# Altium schematic sheet CPCIS_Connectors_P1_P6.SchDoc: =DocumentName
size A3; SPICEModelCacheRMUUFYQV: <root> / <DocumentId>RMUUFYQV</DocumentId> / </root>; DocumentNumber: 1; Revision: 0; SheetNumber: 6; SheetTotal: 17; Last modified by: Krzysztof Belewicz
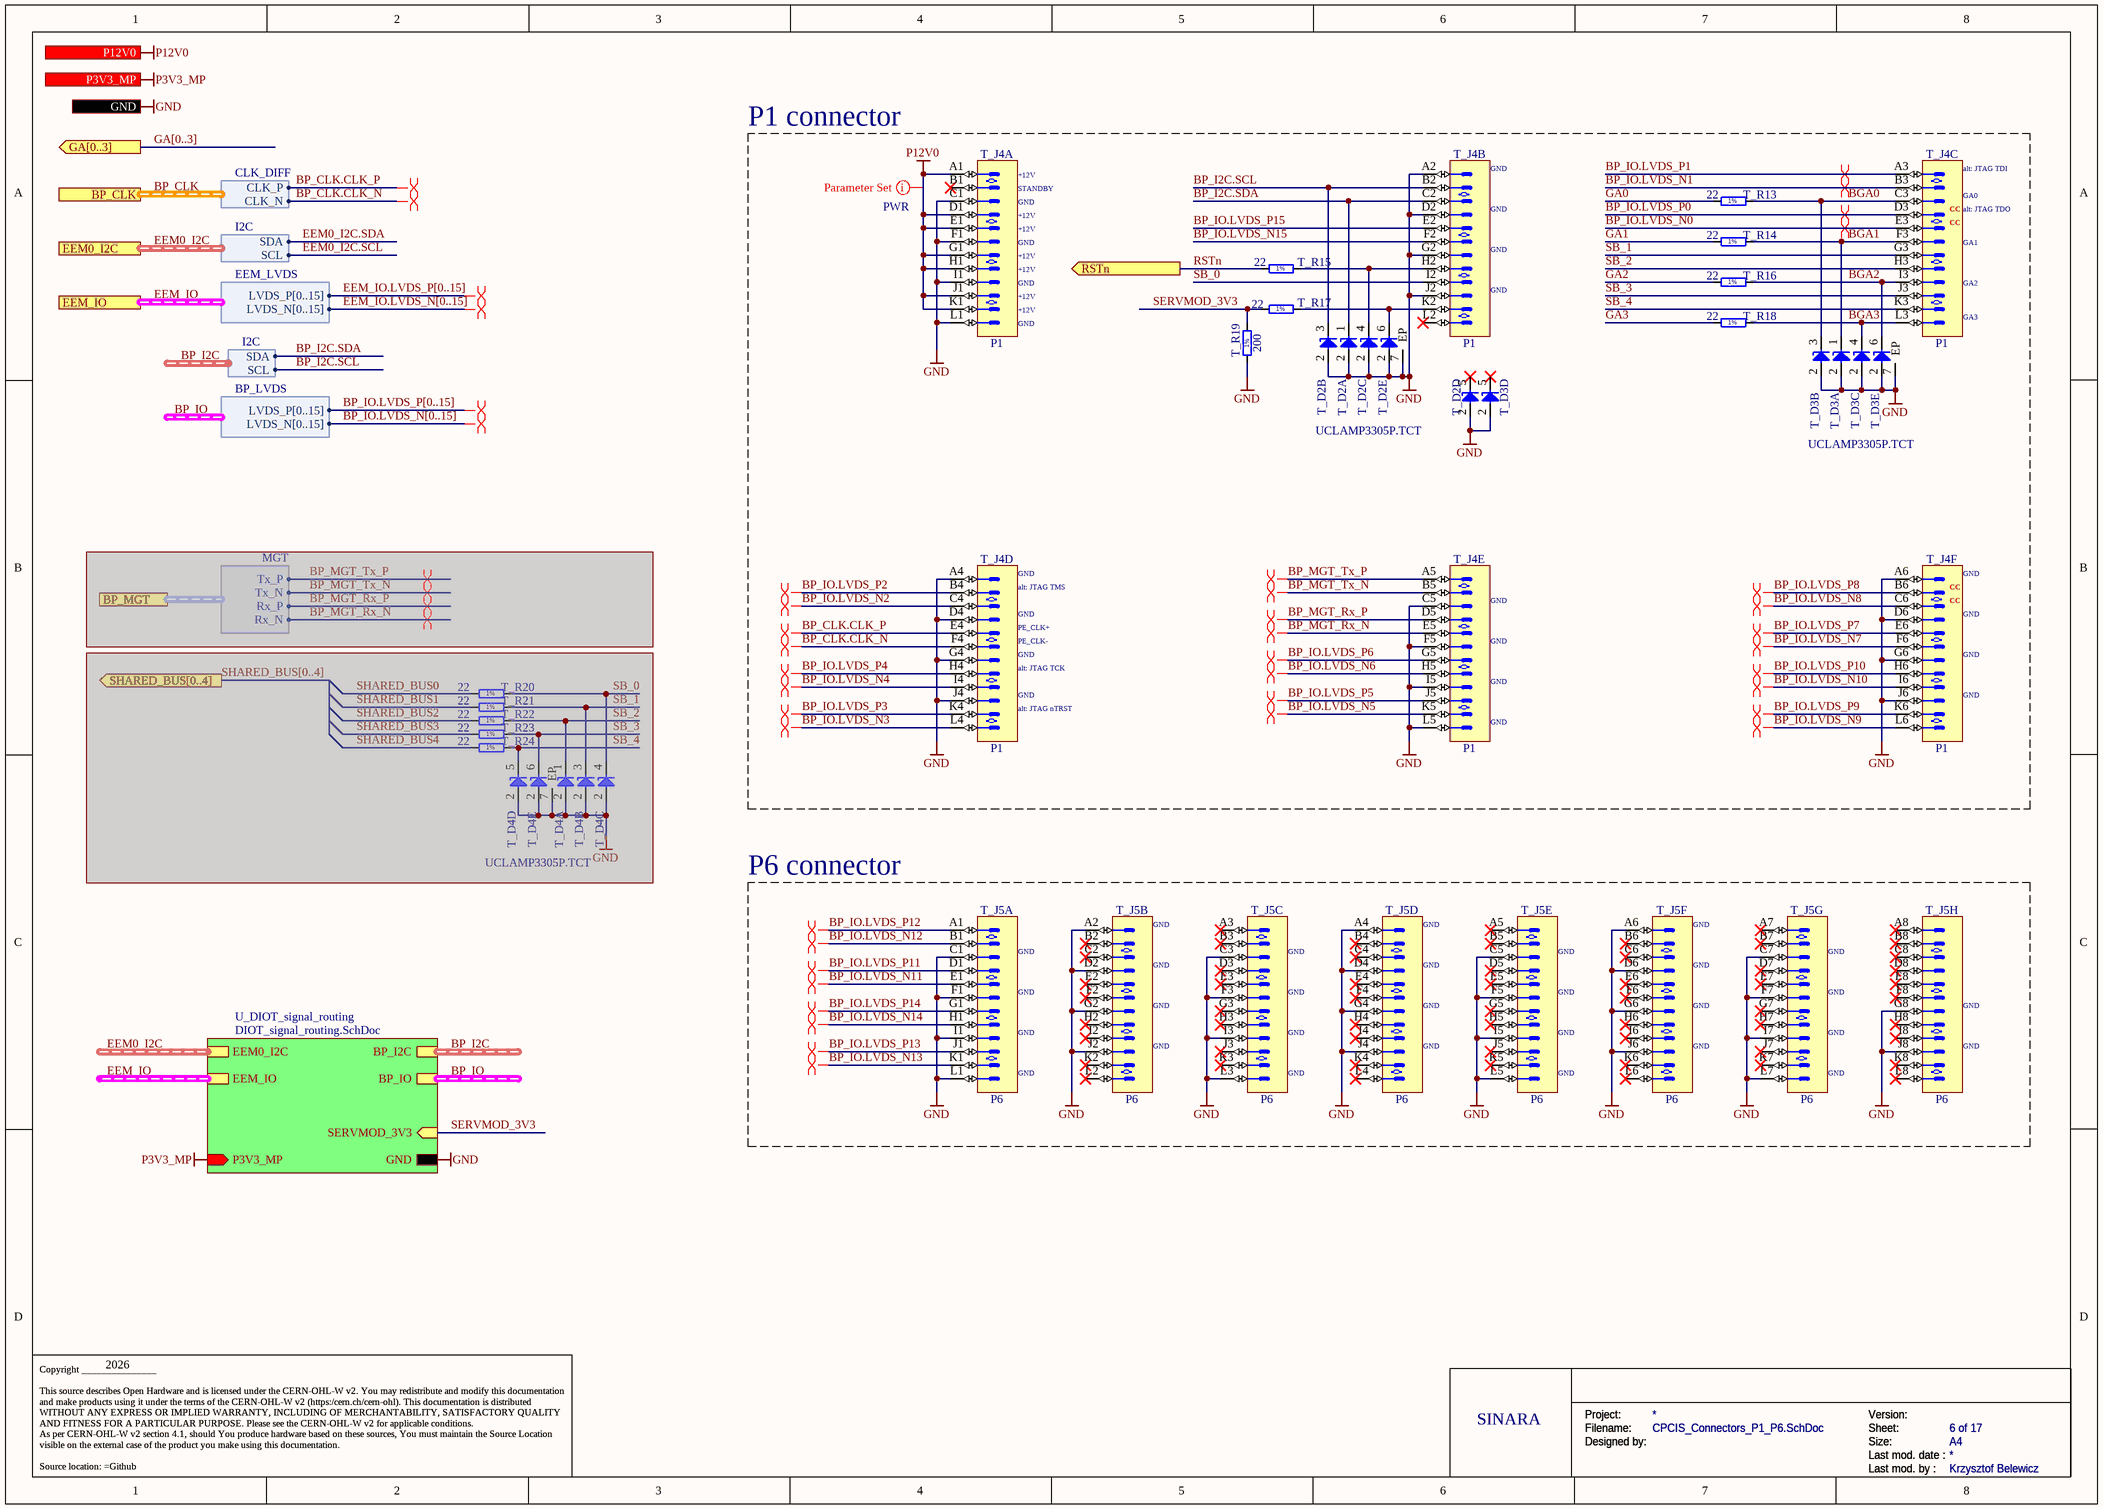
[diagram p0: CPCIS_Connectors_P1_P6.SchDoc]

## Parts
T_D2  UCLAMP3305P.TCT  [SON50P160X65_HS-7N]  (value not drawn)  (parts A,B,C,D,E of 5)
T_D3  UCLAMP3305P.TCT  [SON50P160X65_HS-7N]  (value not drawn)  (parts A,B,C,D,E of 5)
T_D4  UCLAMP3305P.TCT  [SON50P160X65_HS-7N]  (value not drawn)  (parts A,B,C,D,E of 5)  (masked out: inside a compile mask, not in the netlist)
T_J4  P1  [AMPHENOL_10052825-101LF]  (parts A,B,C,D,E,F of 6)
T_J5  P6  [AMPHENOL_10052838-101LF]  (parts A,B,C,D,E,F,G,H of 8)
T_R13  22  [RESC1005X40N]
T_R14  22  [RESC1005X40N]
T_R15  22  [RESC1005X40N]
T_R16  22  [RESC1005X40N]
T_R17  22  [RESC1005X40N]
T_R18  22  [RESC1005X40N]
T_R19  200  [RESC1005X40N]
T_R20  22  [RESC1005X40N]  (masked out: inside a compile mask, not in the netlist)
T_R21  22  [RESC1005X40N]  (masked out: inside a compile mask, not in the netlist)
T_R22  22  [RESC1005X40N]  (masked out: inside a compile mask, not in the netlist)
T_R23  22  [RESC1005X40N]  (masked out: inside a compile mask, not in the netlist)
T_R24  22  [RESC1005X40N]  (masked out: inside a compile mask, not in the netlist)

## Blocks framed on the sheet
P1 connector: T_D2 T_D3 T_J4 T_R13-T_R19
P6 connector: T_J5

## Sub-sheets
U_DIOT_signal_routing = DIOT_signal_routing.SchDoc: BP_I2C (harness I2C), EEM0_I2C (harness I2C), EEM_IO (harness EEM_LVDS), BP_IO (harness BP_LVDS), SERVMOD_3V3 (in), GND, P3V3_MP (in)

## Ports
BP_CLK (harness CLK_DIFF), BP_MGT (harness MGT), EEM0_I2C (harness I2C), EEM_IO (harness EEM_LVDS), GA[0..3] (out), GND, P3V3_MP (in), P12V0 (out), RSTn (out), SHARED_BUS[0..4] (out)

## Harnesses
MGT: Tx_P, Tx_N, Rx_P, Rx_N
CLK_DIFF: CLK_N, CLK_P
I2C: SDA, SCL
EEM_LVDS: LVDS_P[0..15], LVDS_N[0..15]
BP_LVDS: LVDS_N[0..15], LVDS_P[0..15]

## Nets
GND: T_D2.2(A) T_D2.7(EP) T_D3.2(A) T_D3.7(EP) T_J4.A2 T_J4.A4 T_J4.A6 T_J4.C1 T_J4.C5 T_J4.D2 T_J4.D4 T_J4.D6 T_J4.F1 T_J4.F5 T_J4.G2 T_J4.G4 T_J4.G6 T_J4.I1 T_J4.I5 T_J4.J2 T_J4.J4 T_J4.J6 T_J4.L1 T_J4.L5 T_J5.A2 T_J5.A4 T_J5.A6 T_J5.C1 T_J5.C3 T_J5.C5 T_J5.C7 T_J5.D2 T_J5.D4 T_J5.D6 T_J5.F1 T_J5.F3 T_J5.F5 T_J5.F7 T_J5.G2 T_J5.G4 T_J5.G6 T_J5.G8 T_J5.I1 T_J5.I3 T_J5.I5 T_J5.I7 T_J5.J2 T_J5.J4 T_J5.J6 T_J5.J8 T_J5.L1 T_J5.L3 T_J5.L5 T_J5.L7 T_R19.1 ; port GND, sheet U_DIOT_signal_routing/GND
P3V3_MP: port P3V3_MP, sheet U_DIOT_signal_routing/P3V3_MP
P12V0: T_J4.A1 T_J4.D1 T_J4.E1 T_J4.G1 T_J4.H1 T_J4.J1 T_J4.K1 ; port P12V0
BGA0: T_D3.3(C) T_J4.C3 T_R13.2
BGA1: T_D3.1(C) T_J4.F3 T_R14.2
BGA2: T_D3.6(C) T_J4.I3 T_R16.2
BGA3: T_D3.4(C) T_J4.L3 T_R18.2
BP_CLK.CLK_N: T_J4.F4 ; port BP_CLK.CLK_N
BP_CLK.CLK_P: T_J4.E4 ; port BP_CLK.CLK_P
BP_I2C.SCL: T_D2.3(C) T_J4.B2 ; sheet U_DIOT_signal_routing/BP_I2C.SCL
BP_I2C.SDA: T_D2.1(C) T_J4.C2 ; sheet U_DIOT_signal_routing/BP_I2C.SDA
BP_IO.LVDS_N0: T_J4.E3
BP_IO.LVDS_N1: T_J4.B3
BP_IO.LVDS_N2: T_J4.C4
BP_IO.LVDS_N3: T_J4.L4
BP_IO.LVDS_N4: T_J4.I4
BP_IO.LVDS_N5: T_J4.K5
BP_IO.LVDS_N6: T_J4.H5
BP_IO.LVDS_N7: T_J4.F6
BP_IO.LVDS_N8: T_J4.C6
BP_IO.LVDS_N9: T_J4.L6
BP_IO.LVDS_N10: T_J4.I6
BP_IO.LVDS_N11: T_J5.E1
BP_IO.LVDS_N12: T_J5.B1
BP_IO.LVDS_N13: T_J5.K1
BP_IO.LVDS_N14: T_J5.H1
BP_IO.LVDS_N15: T_J4.F2
BP_IO.LVDS_P0: T_J4.D3
BP_IO.LVDS_P1: T_J4.A3
BP_IO.LVDS_P2: T_J4.B4
BP_IO.LVDS_P3: T_J4.K4
BP_IO.LVDS_P4: T_J4.H4
BP_IO.LVDS_P5: T_J4.J5
BP_IO.LVDS_P6: T_J4.G5
BP_IO.LVDS_P7: T_J4.E6
BP_IO.LVDS_P8: T_J4.B6
BP_IO.LVDS_P9: T_J4.K6
BP_IO.LVDS_P10: T_J4.H6
BP_IO.LVDS_P11: T_J5.D1
BP_IO.LVDS_P12: T_J5.A1
BP_IO.LVDS_P13: T_J5.J1
BP_IO.LVDS_P14: T_J5.G1
BP_IO.LVDS_P15: T_J4.E2
BP_MGT_Rx_N: T_J4.E5
BP_MGT_Rx_P: T_J4.D5
BP_MGT_Tx_N: T_J4.B5
BP_MGT_Tx_P: T_J4.A5
EEM0_I2C.SCL: port EEM0_I2C.SCL
EEM0_I2C.SDA: port EEM0_I2C.SDA
GA0: T_R13.1
GA1: T_R14.1
GA2: T_R16.1
GA3: T_R18.1
RSTn: T_R15.1 ; port RSTn
SB_0: T_J4.I2
SB_1: T_J4.G3
SB_2: T_J4.H3
SB_3: T_J4.J3
SB_4: T_J4.K3
SERVMOD_3V3: T_R17.1 T_R19.2 ; sheet U_DIOT_signal_routing/SERVMOD_3V3
NetT_D2_4: T_D2.4(C) T_J4.H2 T_R15.2
NetT_D2_6: T_D2.6(C) T_J4.K2 T_R17.2

Not connected (* = marked no-connect by the designer): T_D2 5(C)*; T_D3 5(C)*; T_J4 B1* L2*; T_J5 A3* A5* A7* A8* B2* B3* B4* B5* B6* B7* B8* C2* C4* C6* C8* D3* D5* D7* D8* E2* E3* E4* E5* E6* E7* E8* F2* F4* F6* F8* G3* G5* G7* H2* H3* H4* H5* H6* H7* H8* I2* I4* I6* I8* J3* J5* J7* K2* K3* K4* K5* K6* K7* K8* L2* L4* L6* L8*

## Buses and harness runs
bus BP_IO.LVDS_N[0..15]
bus BP_IO.LVDS_P[0..15]
bus EEM_IO.LVDS_N[0..15]
bus EEM_IO.LVDS_P[0..15]
bus GA[0..3] = port GA[0..3]
harness BP_CLK = port BP_CLK
harness BP_I2C = sheet U_DIOT_signal_routing/BP_I2C
harness BP_IO = sheet U_DIOT_signal_routing/BP_IO
harness EEM0_I2C = port EEM0_I2C
harness EEM0_I2C = sheet U_DIOT_signal_routing/EEM0_I2C
harness EEM_IO = port EEM_IO
harness EEM_IO = sheet U_DIOT_signal_routing/EEM_IO

## Layout directives
differential pair: (no net found under the mark), BP_IO.LVDS_N0, BP_IO.LVDS_N1, BP_IO.LVDS_N2, BP_IO.LVDS_N3, BP_IO.LVDS_N4, BP_IO.LVDS_N5, BP_IO.LVDS_N6, BP_IO.LVDS_N7, BP_IO.LVDS_N8, BP_IO.LVDS_N9, BP_IO.LVDS_N10, BP_IO.LVDS_N11, BP_IO.LVDS_N12, BP_IO.LVDS_N13, BP_IO.LVDS_N14, BP_IO.LVDS_P0, BP_IO.LVDS_P1, BP_IO.LVDS_P2, BP_IO.LVDS_P3, BP_IO.LVDS_P4, BP_IO.LVDS_P5, BP_IO.LVDS_P6, BP_IO.LVDS_P7, BP_IO.LVDS_P8, BP_IO.LVDS_P9, BP_IO.LVDS_P10, BP_IO.LVDS_P11, BP_IO.LVDS_P12, BP_IO.LVDS_P13, BP_IO.LVDS_P14
differential pair; differential pair class Diff_100Ohm: (no net found under the mark), BP_CLK.CLK_N, BP_CLK.CLK_P
differential pair; differential pair class MGT: (no net found under the mark), BP_MGT_Rx_N, BP_MGT_Rx_P, BP_MGT_Tx_N, BP_MGT_Tx_P
net class PWR: P12V0

## Notes on the sheet
- (near T_J4) +12V
- (near T_J4) GND
- (near T_J4) alt: JTAG TDI
- (near T_J4) STANDBY
- (near T_J4) CC
- (near T_J4) alt: JTAG TDO
- (near T_J4) GA1
- (near T_J4) GA0
- (near T_J4) GA2
- (near T_J4) GA3
- (near T_J4) alt: JTAG TMS
- (near T_J4) PE_CLK+
- (near T_J4) PE_CLK-
- (near T_J4) alt: JTAG TCK
- (near T_J4) alt: JTAG nTRST
- (near T_J5) GND
- 2026
- SINARA
- Project:
- Designed by:
- Filename:
- Size:
- Version:
- Last mod. date :
- Sheet:
- A4
- Copyright _______________
  This source describes Open Hardware and is licensed under the CERN-OHL-W v2. You may redistribute and modify this documentation and make products using it under the terms of the CERN-OHL-W v2 (https:/cern.ch/cern-ohl). This documentation is distributed WITHOUT ANY EXPRESS OR IMPLIED WARRANTY, INCLUDING OF MERCHANTABILITY, SATISFACTORY QUALITY AND FITNESS FOR A PARTICULAR PURPOSE. Please see the CERN-OHL-W v2 for applicable conditions.
  As per CERN-OHL-W v2 section 4.1, should You produce hardware based on these sources, You must maintain the Source Location visible on the external case of the product you make using this documentation.
  Source location: =Github
- Last mod. by :
- (in symbol R0402_22R_1%_0.0625W_100PPM) 1%
- (in symbol R0402_200R_1%_0.0625W_100PPM) 1%

## Library data of the parts
T_D2-T_D4 = CMP-004-00037-2: Diode TVS Quint Common Anode Uni-Dir 3.3V 40W 6-Pin SLP EP T/R; Max Operating Temperature: 125°C; Min Operating Temperature: -55°C; Pins: 6; Mounting Technology: Surface Mount
T_J4 = AMPHENOL_10052825-101LF: 72 Contacts Header, 6 Columns, 4 Pairs per Column; Part Description: 72 Contacts, 2mm Pitch, 6 Columns, 4 Pairs per Column, 4 Walls, Right Angle Header; Part Number: AMPHENOL_10052825-101LF; Component Kind: Standard; Component Type: Standard; Pin Count: 72; Family: AirMax VS; Mounted: Yes; Socket: No; SMD: No; PressFit: Yes; Sense: No; Status: None; Manufacturer: AMPHENOL; Manufacturer Part Number: 10052825-101LF; ComponentHeight: 15.35mm; HelpURL: \\cern.ch\dfs\Applications\Altium\Datasheets\AMPHENOL_10052825-101LF.pdf; ComponentLink1URL: \\cern.ch\dfs\Applications\Altium\Datasheets\AMPHENOL_10052825-101LF_Application.pdf; ComponentLink1Description: Application; Author: CERN DEM MR; CreateDate: 19/02/2018; LatestRevisionDate: 19/02/2018; Classname: Overlapping
T_J5 = AMPHENOL_10052838-101LF: 96 Contacts Header, 8 Columns, 4 Pairs per Column; Part Description: 96 Contacts, 2mm Pitch, 8 Columns, 4 Pairs per Column, 4 Walls, Right Angle Header; Part Number: AMPHENOL_10052838-101LF; Component Kind: Standard; Component Type: Standard; Pin Count: 96; Family: AirMax VS; Mounted: Yes; Socket: No; SMD: No; PressFit: Yes; Sense: No; Status: None; Manufacturer: AMPHENOL; Manufacturer Part Number: 10052838-101LF; ComponentHeight: 15.35mm; HelpURL: \\cern.ch\dfs\Applications\Altium\Datasheets\AMPHENOL_10052838-101LF.pdf; ComponentLink1URL: \\cern.ch\dfs\Applications\Altium\Datasheets\AMPHENOL_10052838-101LF_Application.pdf; ComponentLink1Description: Application; Author: CERN DEM MR; CreateDate: 19.02.2018; LatestRevisionDate: 19.02.2018
T_R13-T_R18 T_R20-T_R24 = R0402_22R_1%_0.0625W_100PPM: Resistor - 1%; Part Description: General Purpose Thick Film Chip Resistor; Manufacturer: GENERIC; Manufacturer1 Part Number: 232270672209L; PressFit: No; Part Number: R0402_22R_1%_0.0625W_100PPM; Component Kind: Standard; Component Type: Standard; Pin Count: 2; Value: 22; Status: Not Recommended; Power: 0.0625W; Tolerance: ±1%; Manufacturer Part Number: R0402_22R_1%_0.0625W_100PPM; Case: 0402; Mounted: Yes; Socket: No; SMD: Yes; Manufacturer1 Example: YAGEO PHYCOMP; Manufacturer1 ComponentHeight: 0.4mm; HelpURL: \\cern.ch\dfs\Applications\Altium\Datasheets\R0402_Phycomp_RC0402.pdf; Author: CERN DEM JLC; CreateDate: 03.12.2007; LatestRevisionDate: 17.10.2012; Sense: No
T_R19 = R0402_200R_1%_0.0625W_100PPM: Resistor - 1%; Part Description: General Purpose Thick Film Chip Resistor; Manufacturer: GENERIC; Manufacturer1 Part Number: 232270672001L; TC: ±100ppm/°C; PressFit: No; Part Number: R0402_200R_1%_0.0625W_100PPM; Component Kind: Standard; Component Type: Standard; Pin Count: 2; Value: 200; Status: Not Recommended; Power: 0.0625W; Tolerance: ±1%; Manufacturer Part Number: R0402_200R_1%_0.0625W_100PPM; Case: 0402; Mounted: Yes; Sense: No; Socket: No; SMD: Yes; Manufacturer1 Example: YAGEO PHYCOMP; Manufacturer1 ComponentHeight: 0.4mm; HelpURL: \\cern.ch\dfs\Applications\Altium\Datasheets\R0402_Phycomp_RC0402.pdf; Author: CERN DEM JLC; CreateDate: 2007-12-03; LatestRevisionDate: 2012-10-17